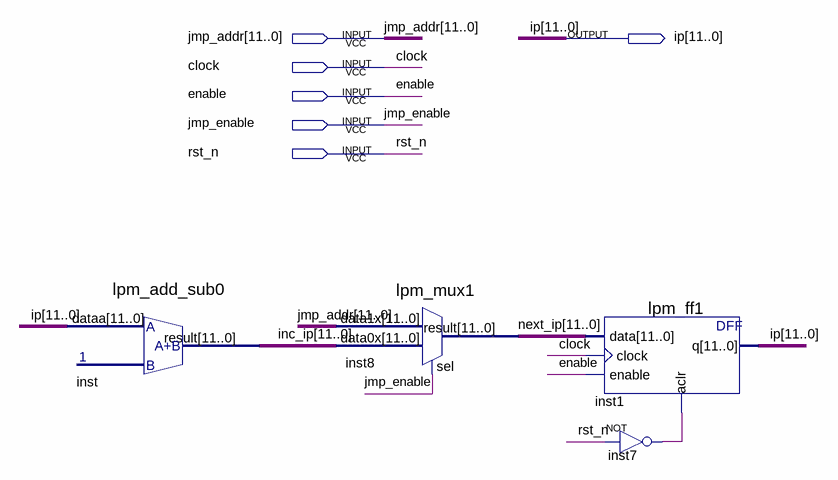
[diagram p0: schematic sheet]
// Quartus schematic ip_unit.bdf as structural Verilog: 4 symbols, 6 pins
module ip_unit (
  input  [11:0] jmp_addr,
  input  clock,
  input  enable,
  input  jmp_enable,
  input  rst_n,
  output [11:0] ip
);

  wire inst7_out;
  wire [11:0] inc_ip, next_ip;

  lpm_add_sub0 inst (.dataa(ip), .result(inc_ip));
  lpm_mux1 inst8 (.data1x(jmp_addr), .data0x(inc_ip), .sel(jmp_enable), .result(next_ip));
  lpm_ff1 inst1 (.data(next_ip), .clock(clock), .enable(enable), .aclr(inst7_out), .q(ip));
  not inst7 (inst7_out, rst_n);
endmodule
